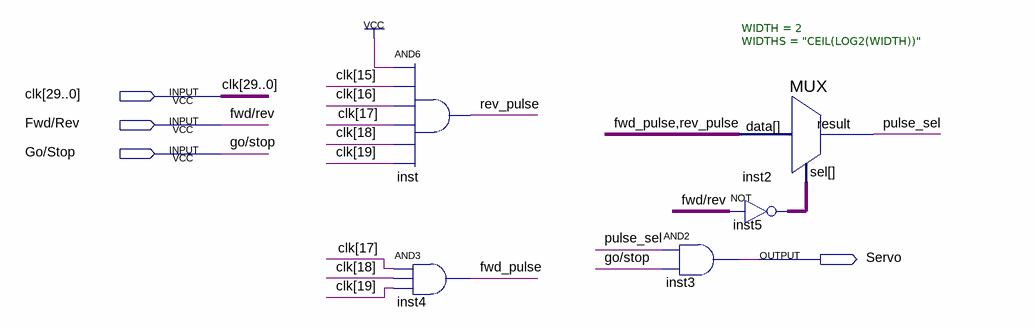
[diagram p0: schematic sheet]
// Quartus schematic Servo_Ctl.bdf as structural Verilog: 5 symbols, 4 pins
module Servo_Ctl (
  input  [29:0] clk,
  input  \Fwd/Rev ,
  input  \Go/Stop ,
  output Servo
);

  wire fwd_pulse, inst5_out, pulse_sel, rev_pulse;

  and inst (rev_pulse, 1'b1, clk[15], clk[16], clk[17], clk[18], clk[19]);
  and inst4 (fwd_pulse, clk[17], clk[18], clk[19]);
  and inst3 (Servo, pulse_sel, \Go/Stop );
  MUX #(.WIDTH(2), .WIDTHS("CEIL(LOG2(WIDTH))")) inst2 (
    .data({fwd_pulse, rev_pulse}), .sel(inst5_out), .result(pulse_sel));
  not inst5 (inst5_out, \Fwd/Rev );
endmodule
